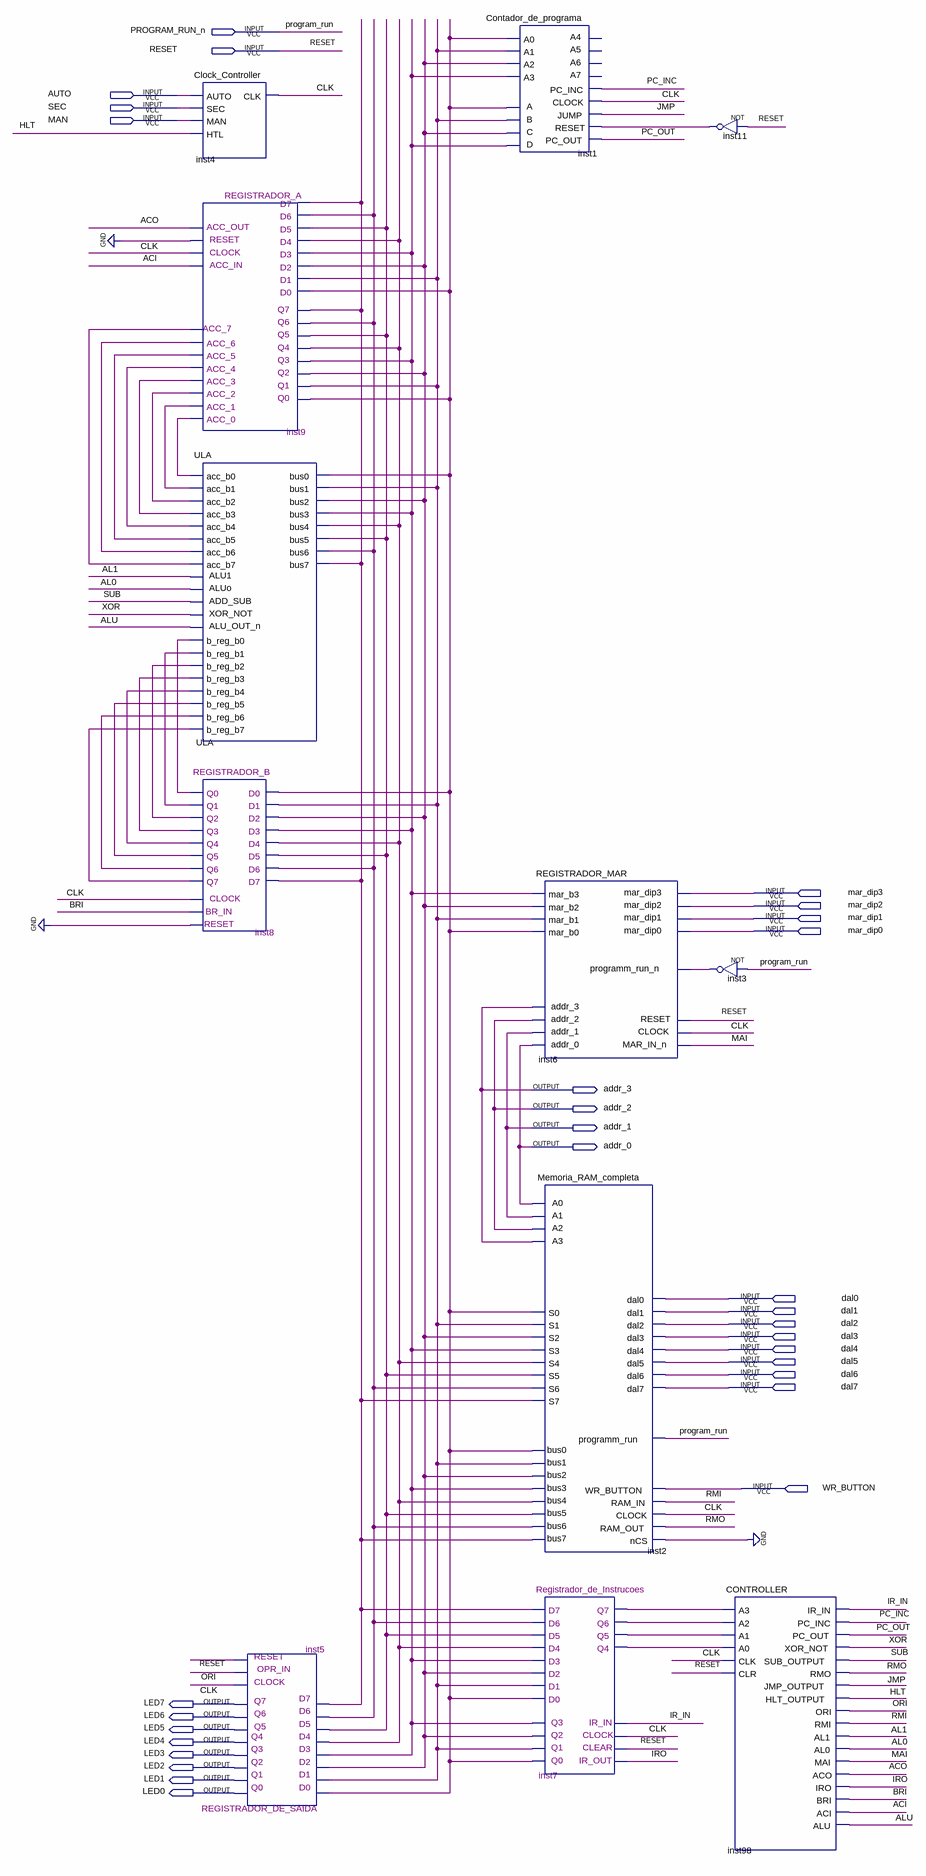
[diagram p0: schematic sheet]
// Quartus schematic SAP_BR.bdf as structural Verilog: 12 symbols, 30 pins
module SAP_BR (
  input  PROGRAM_RUN_n,
  input  RESET,
  input  AUTO,
  input  SEC,
  input  MAN,
  input  mar_dip3,
  input  mar_dip2,
  input  mar_dip1,
  input  mar_dip0,
  input  dal0,
  input  dal1,
  input  dal2,
  input  dal3,
  input  dal4,
  input  dal5,
  input  dal6,
  input  dal7,
  input  WR_BUTTON,
  output addr_3,
  output addr_2,
  output addr_1,
  output addr_0,
  output LED7,
  output LED6,
  output LED5,
  output LED4,
  output LED3,
  output LED2,
  output LED1,
  output LED0
);

  wire ACI, ACO, AL0, AL1, ALU, BRI, CLK, HLT, inst3_out, inst7_q4, inst7_q5, inst7_q6, inst7_q7, inst8_q0,
       inst8_q1, inst8_q2, inst8_q3, inst8_q4, inst8_q5, inst8_q6, inst8_q7, inst9_acc_0, inst9_acc_1,
       inst9_acc_2, inst9_acc_3, inst9_acc_4, inst9_acc_5, inst9_acc_6, inst9_acc_7, inst9_q0, inst9_q1,
       inst9_q2, inst9_q3, inst9_q4, inst9_q5, inst9_q6, inst9_q7, inst11_out, IR_IN, IRO, JMP, MAI, ORI,
       PC_INC, PC_OUT, RMI, RMO, SUB, XOR;

  Clock_Controller inst4 (.AUTO(AUTO), .SEC(SEC), .MAN(MAN), .HTL(HLT), .CLK(CLK));
  REGISTRADOR_A inst9 (
    .D7(inst9_q7), .D6(inst9_q6), .D5(inst9_q5), .D4(inst9_q4), .CLOCK(CLK), .RESET(1'b0), .ACC_IN(ACI),
    .D3(inst9_q3), .D2(inst9_q2), .D1(inst9_q1), .D0(inst9_q0), .ACC_OUT(ACO), .ACC_7(inst9_acc_7),
    .ACC_6(inst9_acc_6), .ACC_5(inst9_acc_5), .ACC_4(inst9_acc_4), .Q7(inst9_q7), .Q6(inst9_q6),
    .Q5(inst9_q5), .Q4(inst9_q4), .Q3(inst9_q3), .Q2(inst9_q2), .Q1(inst9_q1), .Q0(inst9_q0),
    .ACC_3(inst9_acc_3), .ACC_2(inst9_acc_2), .ACC_1(inst9_acc_1), .ACC_0(inst9_acc_0));
  ULA ULA (
    .ALUo(AL0), .ALU1(AL1), .acc_b0(inst9_acc_0), .acc_b1(inst9_acc_1), .acc_b2(inst9_acc_2),
    .acc_b3(inst9_acc_3), .acc_b4(inst9_acc_4), .acc_b5(inst9_acc_5), .acc_b6(inst9_acc_6),
    .acc_b7(inst9_acc_7), .b_reg_b0(inst8_q0), .b_reg_b1(inst8_q1), .b_reg_b2(inst8_q2), .b_reg_b3(inst8_q3),
    .b_reg_b4(inst8_q4), .b_reg_b5(inst8_q5), .b_reg_b6(inst8_q6), .b_reg_b7(inst8_q7), .ADD_SUB(SUB),
    .XOR_NOT(XOR), .ALU_OUT_n(ALU), .bus7(inst9_q7), .bus6(inst9_q6), .bus5(inst9_q5), .bus4(inst9_q4),
    .bus3(inst9_q3), .bus2(inst9_q2), .bus1(inst9_q1), .bus0(inst9_q0));
  REGISTRADOR_B inst8 (
    .D1(inst9_q1), .D2(inst9_q2), .D3(inst9_q3), .CLOCK(CLK), .D4(inst9_q4), .D5(inst9_q5), .D6(inst9_q6),
    .D7(inst9_q7), .BR_IN(BRI), .RESET(1'b0), .D0(inst9_q0), .Q0(inst8_q0), .Q1(inst8_q1), .Q2(inst8_q2),
    .Q3(inst8_q3), .Q4(inst8_q4), .Q5(inst8_q5), .Q6(inst8_q6), .Q7(inst8_q7));
  REGISTRADOR_DE_SAIDA inst5 (
    .D7(inst9_q7), .D6(inst9_q6), .D5(inst9_q5), .D4(inst9_q4), .CLOCK(CLK), .RESET(RESET), .D3(inst9_q3),
    .D2(inst9_q2), .D1(inst9_q1), .D0(inst9_q0), .OPR_IN(ORI), .Q7(LED7), .Q6(LED6), .Q5(LED5), .Q4(LED4),
    .Q3(LED3), .Q2(LED2), .Q1(LED1), .Q0(LED0));
  Contador_de_programa inst1 (
    .CLOCK(CLK), .A(inst9_q0), .RESET(inst11_out), .B(inst9_q1), .JUMP(JMP), .PC_INC(PC_INC), .C(inst9_q2),
    .D(inst9_q3), .PC_OUT(PC_OUT), .A0(inst9_q0), .A1(inst9_q1), .A2(inst9_q2), .A3(inst9_q3));  // open: A4, A5, A6, A7
  REGISTRADOR_MAR inst6 (
    .programm_run_n(inst3_out), .mar_b3(inst9_q3), .mar_b2(inst9_q2), .mar_b1(inst9_q1), .mar_dip3(mar_dip3),
    .mar_b0(inst9_q0), .mar_dip2(mar_dip2), .MAR_IN_n(MAI), .CLOCK(CLK), .mar_dip1(mar_dip1), .RESET(RESET),
    .mar_dip0(mar_dip0), .addr_3(addr_3), .addr_2(addr_2), .addr_1(addr_1), .addr_0(addr_0));
  Memoria_RAM_completa inst2 (
    .WR_BUTTON(WR_BUTTON), .RAM_IN(RMI), .CLOCK(CLK), .A0(addr_0), .A1(addr_1), .A2(addr_2), .A3(addr_3),
    .bus7(inst9_q7), .dal7(dal7), .bus6(inst9_q6), .RAM_OUT(RMO), .dal6(dal6), .bus5(inst9_q5), .dal5(dal5),
    .bus4(inst9_q4), .dal4(dal4), .programm_run(PROGRAM_RUN_n), .dal0(dal0), .bus0(inst9_q0), .dal1(dal1),
    .bus1(inst9_q1), .dal2(dal2), .bus2(inst9_q2), .dal3(dal3), .bus3(inst9_q3), .nCS(1'b0), .S0(inst9_q0),
    .S4(inst9_q4), .S1(inst9_q1), .S5(inst9_q5), .S2(inst9_q2), .S6(inst9_q6), .S3(inst9_q3), .S7(inst9_q7));
  Registrador_de_Instrucoes inst7 (
    .D7(inst9_q7), .D6(inst9_q6), .D5(inst9_q5), .D4(inst9_q4), .IR_IN(IR_IN), .CLOCK(CLK), .CLEAR(RESET),
    .IR_OUT(IRO), .D3(inst9_q3), .D2(inst9_q2), .D1(inst9_q1), .D0(inst9_q0), .Q7(inst7_q7), .Q6(inst7_q6),
    .Q5(inst7_q5), .Q4(inst7_q4), .Q3(inst9_q3), .Q2(inst9_q2), .Q1(inst9_q1), .Q0(inst9_q0));
  not inst11 (inst11_out, RESET);
  not inst3 (inst3_out, PROGRAM_RUN_n);
  CONTROLLER inst98 (
    .A3(inst7_q7), .A2(inst7_q6), .A1(inst7_q5), .A0(inst7_q4), .CLK(CLK), .CLR(RESET), .IR_IN(IR_IN),
    .PC_INC(PC_INC), .PC_OUT(PC_OUT), .XOR_NOT(XOR), .SUB_OUTPUT(SUB), .RMO(RMO), .JMP_OUTPUT(JMP),
    .HLT_OUTPUT(HLT), .ORI(ORI), .RMI(RMI), .AL1(AL1), .AL0(AL0), .MAI(MAI), .ACO(ACO), .IRO(IRO), .BRI(BRI),
    .ACI(ACI), .ALU(ALU));

  // Other names for the same wires on the sheet: program_run = PROGRAM_RUN_n
endmodule
